# Altium schematic sheet Power Conditioning.SchDoc
size A; Organization: Underwater Robotics; Address1: c/o Student Involvement; Address2: Campus Box 7306; Address3: 2016 Cates Ave. Raleigh, NC 27695; Revision: A1; SheetNumber: 3B; SheetTotal: 3B; PageSetup: Record=PageOptions|CenterHorizontal=True|CenterVertical=True|PrintScale=1.00|XCorrection=1.00|YCorrection=1.00|PrintKind=0|BorderSize=5000000|LeftOffset=0|BottomOffset=0|Orientation=2|PaperLength=1000|PaperWidth=1000|Scale=100|PaperSource=7|PrintQuality=-3|MediaType=1|DitherType=10|PrintScaleMode=1|PaperKind=Letter|PaperIndex=1
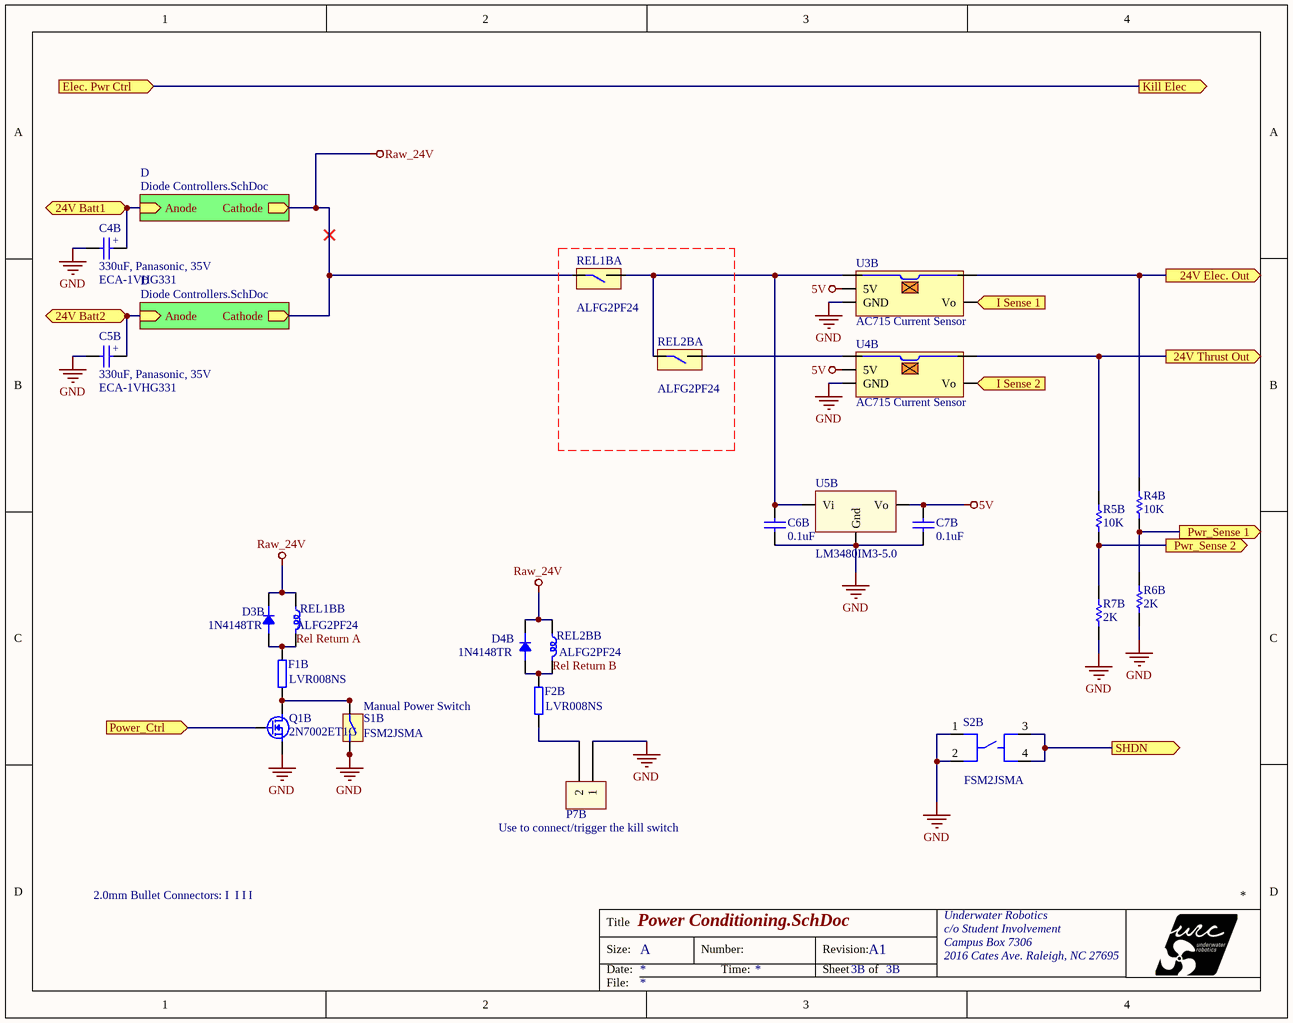
[diagram p0: Power Conditioning.SchDoc]

## Parts
C4B  330uF, Panasonic, 35V  Manufacturer Part Number: ECA-1VHG331  [10mm Radial Cap, Generic]
C5B  330uF, Panasonic, 35V  Manufacturer Part Number: ECA-1VHG331  [10mm Radial Cap, Generic]
C6B  value 0.1uF  [C0805]  (hidden comment: 0.1uF, C0805, AVX)
C7B  value 0.1uF  [C0805]  (hidden comment: 0.1uF, C0805, AVX)
D3B  Manufacturer Part Number: 1N4148TR  [DO-35-0.3]  (hidden comment: Diode)
D4B  Manufacturer Part Number: 1N4148TR  [DO-35-0.3]  (hidden comment: Diode)
F1B  Manufacturer Part Number: LVR008NS  [LVR008NS - Resettable Fuse]  (hidden comment: PTC Fuse, LVR008NS)
F2B  Manufacturer Part Number: LVR008NS  [LVR008NS - Resettable Fuse]  (hidden comment: PTC Fuse, LVR008NS)
i1B  2.0mm Bullet Connector (Placeholder)  (value not drawn)
i2B  2.0mm Bullet Connector (Placeholder)  (value not drawn)
i3B  2.0mm Bullet Connector (Placeholder)  (value not drawn)
i4B  2.0mm Bullet Connector (Placeholder)  (value not drawn)
P7B  Header  [1x2 Header]  (value not drawn)
Q1B  Manufacturer Part Number: 2N7002ET1G  [2N7002-SOT23]  (hidden comment: N-MOSFET)
R4B  value 10K  [R0603]  (hidden comment: Resistor)
R5B  value 10K  [R0603]  (hidden comment: Resistor)
R6B  value 2K  [R0603]  (hidden comment: Resistor)
R7B  value 2K  [R0603]  (hidden comment: Resistor)
REL1B  ALFG2PF24  [LF-G Series Relay]  (parts A,B of 2)
REL2B  ALFG2PF24  [LF-G Series Relay]  (parts A,B of 2)
S1B  FSM2JSMA  [FSM2JSMA]
S2B  FSM2JSMA  [FSM2JSMA]
U3B  AC715 Current Sensor  [AC715 Current Sensor]
U4B  AC715 Current Sensor  [AC715 Current Sensor]
U5B  Manufacturer Part Number: LM3480IM3-5.0  [LM4040-SOT23-3]  (hidden comment: LM3480)

## Sub-sheets
D = Diode Controllers.SchDoc: Anode (in), Cathode (out)
D = Diode Controllers.SchDoc: Anode (in), Cathode (out)

## Ports
24V Batt1 (in), 24V Batt2 (in), 24V Elec. Out (out), 24V Thrust Out (out), Elec. Pwr Ctrl (in), I Sense 1 (out), I Sense 2 (out), Kill Elec (out), Power_Ctrl (in), Pwr_Sense 1 (out), Pwr_Sense 2 (out), SHDN (out)

## Nets
5V: C7B.1(+) U3B.5(5V) U4B.5(5V) U5B.2(Vo)
GND: C4B.2 C5B.2 C6B.2 C7B.2 P7B.1 Q1B.S(SOURCE) R6B.1 R7B.1 S1B.3 S1B.4 S2B.1 S2B.2 U3B.3(GND) U4B.3(GND) U5B.1(Gnd)
Raw_24V: D3B.2 D4B.2 REL1B.2 REL1B.4 REL2B.2 ; sheet D/Cathode, sheet D/Cathode
24V Batt1: C4B.1(+) ; port 24V Batt1, sheet D/Anode
24V Batt2: C5B.1(+) ; port 24V Batt2, sheet D/Anode
24V Elec. Out: R4B.2 U3B.2 ; port 24V Elec. Out
24V Thrust Out: R5B.2 U4B.2 ; port 24V Thrust Out
Elec. Pwr Ctrl: port Elec. Pwr Ctrl, port Kill Elec
I Sense 1: U3B.4(Vo) ; port I Sense 1
I Sense 2: U4B.4(Vo) ; port I Sense 2
Power_Ctrl: Q1B.G(GATE) ; port Power_Ctrl
Pwr_Sense 1: R4B.1 R6B.2 ; port Pwr_Sense 1
Pwr_Sense 2: R5B.1 R7B.2 ; port Pwr_Sense 2
Rel Return A: D3B.1 F1B.1 REL1B.1
Rel Return B: D4B.1 F2B.1 REL2B.1
SHDN: S2B.3 S2B.4 ; port SHDN
NetC6B_1: C6B.1(+) REL1B.3 REL2B.4 U3B.1 U5B.3(Vi)
NetF1B_2: F1B.2 Q1B.D(DRAIN) S1B.1 S1B.2
NetF2B_2: F2B.2 P7B.2
NetREL2B_3: REL2B.3 U4B.1

## Notes on the sheet
- (near S1B) Manual Power Switch
- (near P7B) Use to connect/trigger the kill switch
- Title
- Size:
- Date:
- A
- Number:
- Time:
- Revision:
- Sheet
- of
- File:
- (in symbol 2.0mm Bullet Connector (Placeholder)) 2.0mm Bullet Connectors: I; I

## Library data of the parts
C4B C5B = 330uF, Panasonic, 35V: Manufacturer 1: PANASONIC ELECTRONIC COMPONENTS; Description 1: PANASONIC ELECTRONIC COMPONENTS - ECA-1VHG331 - ALUMINUM ELECTROLYTIC CAPACITOR, 330UF, 20%, 35V, RADIAL; Product Range: NHG Series; Capacitance: 330 F; Capacitance Tolerance: 20%; Voltage Rating: 35; Capacitor Terminals: Radial Leaded; Supplier 1: Newark; Supplier Part Number 1: 17T5027; RoHS: YES; Stock 1: 465; Pricing 1: 1=0.575, 10=0.38, 25=0.324, 50=0.276, 100=0.246, 250=0.213, 500=0.182, 1000=0.147 (USD); Diameter: 10; Packaging: Each; ESR: -; ComponentLink1URL: http://www.farnell.com/cad/1703906.zip; ComponentLink1Description: http://www.farnell.com/cad/1703906.zip; ComponentLink2URL: http://www.farnell.com/datasheets/1903322.pdf; ComponentLink2Description: http://www.farnell.com/datasheets/1903322.pdf
C6B C7B = 0.1uF, C0805, AVX: Ceramic MLCC, AVX, X5R Dielectric; Manufacturer Part Number: 08055C104JAT2A; Description 1: AVX - 08055C104JAT2A - MLCC CAPACITOR, 0.1uF, 50V, X7R, 5%, 0805; Capacitance: 0.1 F; Capacitance Tolerance: 5%; Dielectric Characteristic: X7; Voltage Rating: 50; Ceramic Capacitor Case: 0805 [2012 Metric]; Supplier 1: Newark; Supplier Part Number 1: 96K4778; Manufacturer 1: AVX; RoHS: YES; Stock 1: 26154; Pricing 1: 1=0.009, 10=0.009, 100=0.009, 250=0.009, 500=0.009, 1000=0.009 (USD); Product Range: -; Operating Temperature Min: -55 C; ComponentLink1URL: http://www.farnell.com/datasheets/1818074.pdf; ComponentLink1Description: http://www.farnell.com/datasheets/1818074.pdf
D3B D4B = Diode: General Purpose Diode; Manufacturer 1: FAIRCHILD SEMICONDUCTOR; Description 1: FAIRCHILD SEMICONDUCTOR - 1N4148TR - SMALL SIGNAL DIODE 100V 200mA DO-35; Diode Configuration: Single; Repetitive Reverse Voltage Vrrm Max: 100; Forward Current If(AV): 200; Forward Voltage VF Max: 1; Reverse Recovery Time trr Max: 4; Supplier 1: Newark; Supplier Part Number 1: 05R0353; RoHS: YES; Stock 1: 12584; Pricing 1: 1=0.063, 10=0.052, 100=0.018, 1000=0.013, 2500=0.01 (USD); Forward Surge Current Ifsm Max: 4; ComponentLink1URL: http://www.farnell.com/datasheets/1934602.pdf; ComponentLink1Description: http://www.farnell.com/datasheets/1934602.pdf; ComponentLink2URL: http://www.fairchildsemi.com/ds/1N%2F1N4148.pdf; ComponentLink2Description: http://www.fairchildsemi.com/ds/1N%2F1N4148.pdf
F1B F2B = PTC Fuse, LVR008NS: Generic Fuse; Manufacturer 1: TE CONNECTIVITY / RAYCHEM; Description 1: TE CONNECTIVITY / RAYCHEM - LVR008NS - FUSE, PTC RESET, 240V, 80mA, RADIAL; Product Range: PolySwitch LVR Series; Holding Current: 80; Tripping Current: 190; Voltage Rating: 240; Thermistor Mounting: Through Hole; External Depth: 4.6; Supplier 1: Newark; Supplier Part Number 1: 45P7788; RoHS: YES; Stock 1: 919; Pricing 1: 1=0.46, 10=0.46, 100=0.409, 500=0.369, 1000=0.318, 2000=0.312, 5000=0.29, 10000=0.247 (USD); Operating Temperature Min: -40 C; ComponentLink1URL: http://www.farnell.com/datasheets/1902602.pdf; ComponentLink1Description: http://www.farnell.com/datasheets/1902602.pdf
i1B i2B i3B i4B = 2.0mm Bullet Connector (Placeholder): Typical 2.0mm bullet connector used in RC Electronics; Supplier 1: eBay; URL: http://www.ebay.com/itm/2-0mm-Gold-Plated-Bullet-Banana-Plug-Connector-for-RC-Battery-10-Pairs-EM-01-/380940680315?hash=item58b1d57c7b:g:4qgAAOSwqu9U~~mJ; Supplier Unit Price 1: 0.319; Supplier Part Number 1: 884853846561
P7B = 1x2 Header
Q1B = N-MOSFET: N-Channel MOSFET; Manufacturer 1: ON SEMICONDUCTOR; Description 1: ON SEMICONDUCTOR - 2N7002ET1G - N CHANNEL MOSFET, 60V, 310mA SOT-23; Supplier Part Number 1: 09R9861; Supplier 1: Newark; RoHS: YES; Stock 1: 18061; Pricing 1: 1=0.018, 50=0.018, 100=0.018, 250=0.018, 500=0.018, 1000=0.018, 3000=0.016, 9000=0.016 (USD); ComponentLink1URL: http://www.farnell.com/datasheets/1708226.pdf; ComponentLink1Description: http://www.farnell.com/datasheets/1708226.pdf
R4B R5B = 10k, 1%, 100mW, Yageo, R0603: Manufacturer 1: YAGEO; Manufacturer Part Number: RC0603FR-1010KL; Tolerance: 1%; Description 1: YAGEO - RC0603FR-1010KL - RES, THICK FILM, 10K, 1%, 0.1W, 0603; Product Range: RC Series; Resistance: 10; Power Rating: 100; Voltage Rating: 50; Resistor Case Style: 0603 [1608 Metric]; Body Length: 1.6; Supplier 1: Newark; Supplier Part Number 1: 68R0120; RoHS: YESX; Stock 1: 7839; Pricing 1: 1=0.002, 10=0.002, 25=0.002, 100=0.002, 250=0.002, 1000=0.002 (USD); Resistance Tolerance: 1%; Packaging: Cut Tape; MSL: -; ComponentLink1URL: http://www.farnell.com/datasheets/1868787.pdf; ComponentLink1Description: http://www.farnell.com/datasheets/1868787.pdf; ComponentLink2URL: http://www.yageo.com/pdf/PYu-RC0603_51_RoHS_L_4.pdf; ComponentLink2Description: http://www.yageo.com/pdf/PYu-RC0603_51_RoHS_L_4.pdf
R6B R7B = 2k, 1%, 100mW, Yageo, R0603: Manufacturer 1: YAGEO; Manufacturer Part Number: RC0603FR-072KL; Tolerance: 1%; Description 1: YAGEO - RC0603FR-072KL - RES, THICK FILM, 2K, 1%, 0.1W, 0603; Supplier 1: Newark; Supplier Part Number 1: 68R0063; RoHS: YESX; Stock 1: 2730; Pricing 1: 1=0.09, 10=0.015, 25=0.011, 100=0.006, 250=0.004, 1000=0.003 (USD); ComponentLink1URL: http://www.farnell.com/datasheets/1868787.pdf; ComponentLink1Description: http://www.farnell.com/datasheets/1868787.pdf; ComponentLink2URL: http://www.yageo.com/pdf/PYu-RC0603_51_RoHS_L_4.pdf; ComponentLink2Description: http://www.yageo.com/pdf/PYu-RC0603_51_RoHS_L_4.pdf
REL1B REL2B = ALFG2PF24: 24V, 33A General Purpose Relay; Manufacturer 1: PANASONIC ELECTRIC WORKS; Description 1: PANASONIC ELECTRIC WORKS - ALFG2PF24 - RELAY, SPST-NO, 277VAC, 31A; Supplier 1: Newark; Supplier Part Number 1: 31T8165; RoHS: YES; Stock 1: 55; Pricing 1: 1=6.62, 100=5.41, 250=4.96, 500=4.61, 1000=4.33 (USD); ComponentLink1URL: http://www.farnell.com/datasheets/1022057.pdf; ComponentLink1Description: http://www.farnell.com/datasheets/1022057.pdf; ComponentLink2URL: http://www.farnell.com/datasheets/1012515.pdf; ComponentLink2Description: http://www.farnell.com/datasheets/1012515.pdf; Manufacturer Part Number: ALFG2PF24
S1B S2B = FSM2JSMA: Tactile Switch (OFF-MOM); Manufacturer 1: TE CONNECTIVITY / ALCOSWITCH; Description 1: TE CONNECTIVITY / ALCOSWITCH - FSM2JSMA - SWITCH, TACTILE, SPST-NO, 50mA, SMD; URL: http://search.digikey.com/us/en/products/FSM2JSMA/450-1130-ND/525819; Supplier 1: Newark; Supplier Part Number 1: 92F2864; Manufacturer Part Number: FSM2JSMA; RoHS: YES; Stock 1: 273; Pricing 1: 1=0.28, 10=0.262, 25=0.253, 50=0.244, 100=0.23, 250=0.217, 500=0.208, 1000=0.158 (USD); ComponentLink1URL: http://www.tycoelectronics.com/commerce/DocumentDelivery/DDEController?Action=showdoc&DocId=Catalog+Section%7F1308111-1_SWITCHES_CORE_PROGRAM_CATALOG%7F0308%7Fpdf%7FEnglish%7FENG_CS_1308111-1_SWITCHES_CORE_PROGRAM_CATALOG_0308.pdf%7F1825041-1; ComponentLink1Description: http://www.tycoelectronics.com/commerce/DocumentDelivery/DDEController?Action=showdoc&DocId=Catalog+Section%7F1308111-1_SWITCHES_CORE_PROGRAM_CATALOG%7F0308%7Fpdf%7FEnglish%7FENG_CS_1308111-1_SWITCHES_CORE_PROGRAM_CATALOG_0308.pdf%7F1825041-1; ComponentLink2URL: http://www.farnell.com/cad/1650702.pdf; ComponentLink2Description: http://www.farnell.com/cad/1650702.pdf; ComponentLink3URL: http://www.farnell.com/datasheets/1668117.pdf; ComponentLink3Description: http://www.farnell.com/datasheets/1668117.pdf; ComponentLink4URL: http://www.farnell.com/datasheets/921681.pdf; ComponentLink4Description: http://www.farnell.com/datasheets/921681.pdf; ComponentLink5URL: http://ecommas.tycoelectronics.com/commerce/DocumentDelivery/DDEController?Action=showdoc&DocId=Catalog+Page%7F1308390_0904_E3_E10%7Fn%2Fa%7Fpdf%7FEnglish%7FENG_CAT_1308390_0904_E3_E10_.pdf; ComponentLink5Description: http://ecommas.tycoelectronics.com/commerce/DocumentDelivery/DDEController?Action=showdoc&DocId=Catalog+Page%7F1308390_0904_E3_E10%7Fn%2Fa%7Fpdf%7FEnglish%7FENG_CAT_1308390_0904_E3_E10_.pdf
U3B U4B = AC715 Current Sensor: Manufacturer Part Number: 1186; Supplier Unit Price 1: 9.95; Supplier Part Number 1: 1186; Supplier 1: Pololu
U5B = LM3480: 5V, 0.1A Fixed LDO; pin to pad: 1>3 2>1 3>2; Manufacturer 1: TEXAS INSTRUMENTS; Description 1: TEXAS INSTRUMENTS - LM3480IM3-5.0 - LDO VOLTAGE REGULATOR, 5V, 0.1A, 3-SOT-23; Input Voltage Min: 0; Input Voltage Max: 30; Output Current: 100; Dropout Voltage Vdo: 900; LDO Regulator Case Style: SOT-23; No. of Pins: 3; Supplier 1: Newark; RoHS: NO; Stock 1: 132; Pricing 1: 1=1.24, 10=0.986, 100=0.757, 1000=0.529 (USD); ComponentLink1URL: http://www.farnell.com/cad/1562346.zip; ComponentLink1Description: http://www.farnell.com/cad/1562346.zip; Supplier Part Number 1: 83F3816; Operating Temperature Min: -40 C; ComponentLink2URL: http://www.farnell.com/datasheets/1853525.pdf; ComponentLink2Description: http://www.farnell.com/datasheets/1853525.pdf